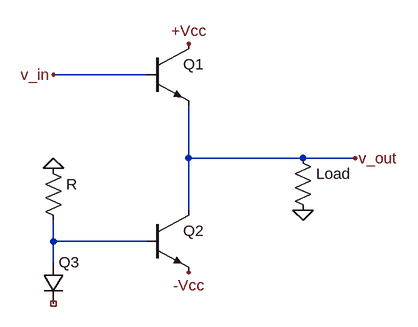
[diagram p0: schematic ClassA.asc]
ClassA.asc, the LTspice schematic file:
Version 4
SHEET 1 880 680
WIRE 144 16 0 16
WIRE 208 144 208 64
WIRE 384 144 208 144
WIRE 464 144 384 144
WIRE 208 224 208 144
WIRE 0 272 0 240
WIRE 144 272 0 272
WIRE 0 304 0 272
FLAG 0 160 0
FLAG 384 224 0
FLAG 208 -32 +Vcc
FLAG 208 320 -Vcc
FLAG 0 16 v_in
FLAG 464 144 v_out
SYMBOL res -16 144 R0
SYMATTR InstName R
SYMATTR Value ""
SYMBOL res 368 128 R0
SYMATTR InstName Load
SYMATTR Value ""
SYMBOL npn 144 -32 R0
SYMATTR InstName Q1
SYMATTR Value ""
SYMBOL npn 144 224 R0
SYMATTR InstName Q2
SYMATTR Value ""
SYMBOL diode -16 304 R0
SYMATTR InstName Q3
SYMATTR Value ""

The netlist it stands for:
* ClassA.asc
R 0 N001
R§Load v_out 0
Q1 +Vcc v_in v_out 0
Q2 v_out N001 -Vcc 0
D§Q3 N001 NC_01
.model D D
.lib standard.dio
.model NPN NPN
.model PNP PNP
.lib standard.bjt
.backanno
.end